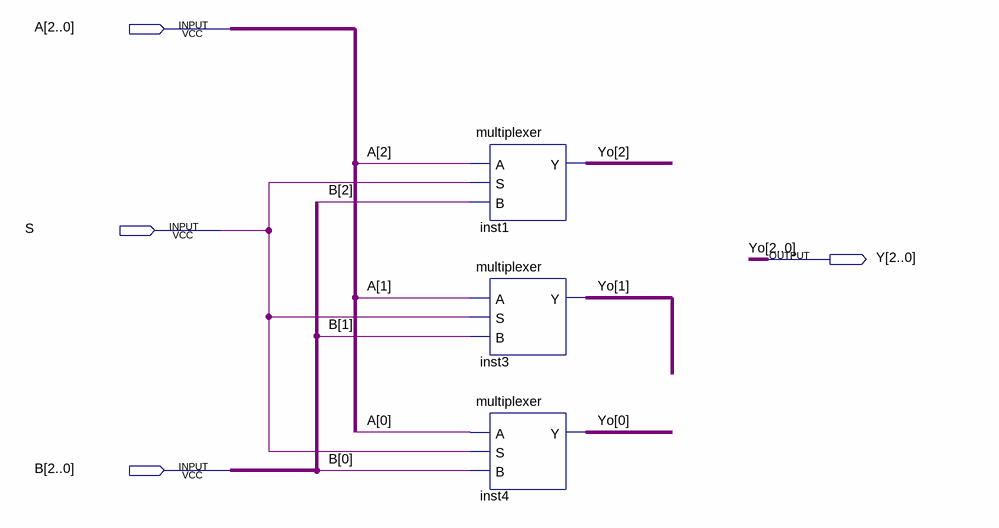
[diagram p0: schematic sheet]
// Quartus schematic mux3.bdf as structural Verilog: 3 symbols, 4 pins
module mux3 (
  input  [2:0] A,
  input  S,
  input  [2:0] B,
  output [2:0] Y
);

  multiplexer inst1 (.A(A[2]), .S(S), .B(B[2]), .Y(Y[2]));
  multiplexer inst3 (.A(A[1]), .S(S), .B(B[1]), .Y(Y[1]));
  multiplexer inst4 (.A(A[0]), .S(S), .B(B[0]), .Y(Y[0]));

  // Other names for the same wires on the sheet: Yo[2:0] = Y
endmodule
